# EAGLE design shield (EAGLE 6.3)
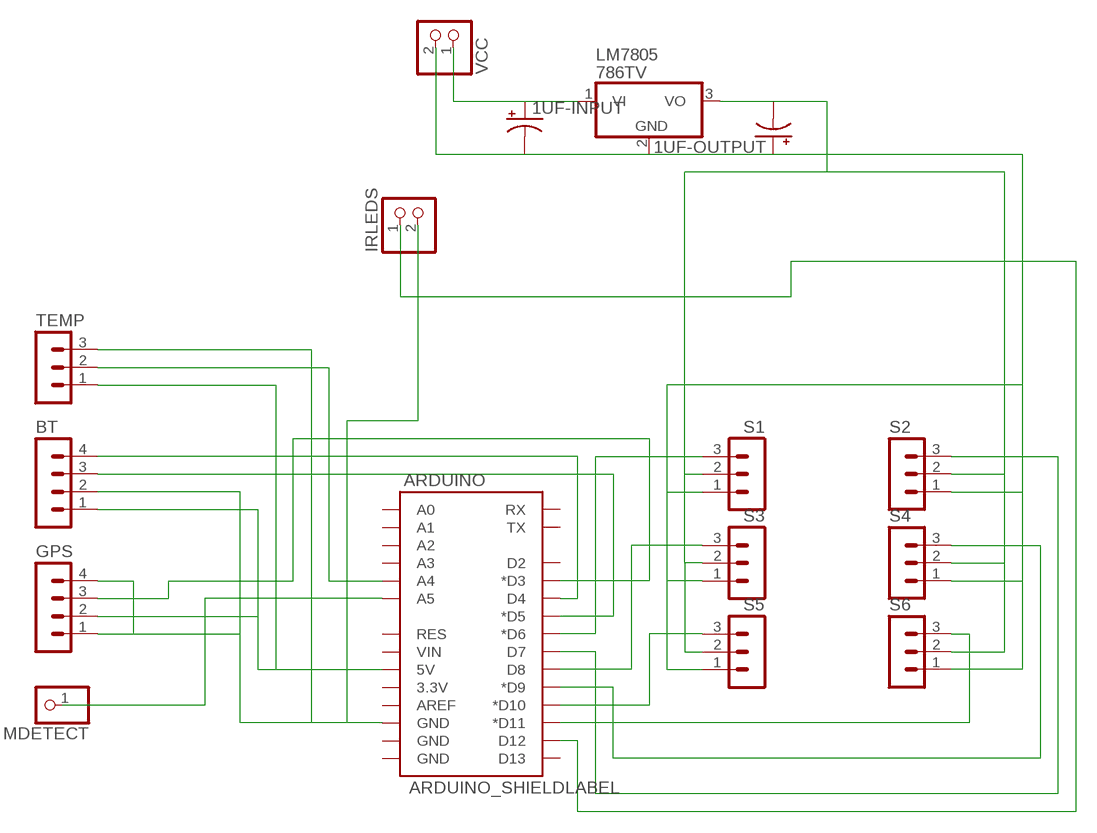
[diagram p0: schematic, sheet 1]

## Parts
1UF-INPUT  CAP_POLPTH4  [CPOL-RADIAL-1000UF-25V]
1UF-OUTPUT  CAP_POLPTH4  [CPOL-RADIAL-1000UF-25V]
ARDUINO  ARDUINO_SHIELDLABEL  [DUEMILANOVE_SHIELD]
BT  MA04-1  [MA04-1]
GPS  MA04-1  [MA04-1]
IRLEDS  PINHD-1X2  [1X02]
LM7805  786TV  [TO220V]
MDETECT  PINHD-1X1  [1X01]
S1  MA03-1  [MA03-1]
S2  MA03-1  [MA03-1]
S3  MA03-1  [MA03-1]
S4  MA03-1  [MA03-1]
S5  MA03-1  [MA03-1]
S6  MA03-1  [MA03-1]
TEMP  MA03-1  [MA03-1]
VCC  PINHD-1X2  [1X02]

## Nets
MDETECT: ARDUINO.A5 MDETECT.1
N$1: ARDUINO.D12 IRLEDS.1
N$3: ARDUINO.D6(*D6) S1.3
N$4: ARDUINO.D7 S2.3
N$5: ARDUINO.D8 S3.3
N$6: ARDUINO.D9(*D9) S4.3
N$7: ARDUINO.D10(*D10) S5.3
N$8: ARDUINO.D11(*D11) S6.3
N$9: ARDUINO.5V BT.1 GPS.2 TEMP.1
N$10: ARDUINO.GND@2(GND) BT.2 GPS.1 GPS.4 IRLEDS.2 TEMP.3
N$11: ARDUINO.D5(*D5) BT.3
N$12: ARDUINO.D4 BT.4
N$13: ARDUINO.D3(*D3) GPS.3
N$14: ARDUINO.A4 TEMP.2
N$15: 1UF-INPUT.1(+) LM7805.1(VI) VCC.1
N$16: 1UF-INPUT.2(-) 1UF-OUTPUT.1(+) LM7805.2(GND) S1.1 S2.1 S3.1 S4.1 S5.1 S6.1 VCC.2
N$17: 1UF-OUTPUT.2(-) LM7805.3(VO) S1.2 S2.2 S3.2 S4.2 S5.2 S6.2
Unconnected: ARDUINO.3.3V ARDUINO.A0 ARDUINO.A1 ARDUINO.A2 ARDUINO.A3 ARDUINO.AREF ARDUINO.D2 ARDUINO.D13 ARDUINO.GND@0(GND) ARDUINO.GND@1(GND) ARDUINO.RES ARDUINO.RX ARDUINO.TX ARDUINO.VIN

## Library data of the parts
1UF-INPUT 1UF-OUTPUT = SparkFun-Passives:CAP_POL: Capacitor Polarized These are standard SMD and PTH capacitors. Normally 10uF, 47uF, and 100uF in electrolytic and tantalum varieties. Always verify the external diameter of the through hole cap, it varies with capacity, voltage, and manufacturer. The EIA devices should be standard.
ARDUINO = SparkFun-Boards:ARDUINO_SHIELD: Arduino shield footprint
BT GPS = con-lstb:MA04-1: PIN HEADER; OC_FARNELL: unknown; OC_NEWARK: unknown
IRLEDS VCC = pinhead:PINHD-1X2: PIN HEADER
LM7805 = linear:78*: Positive VOLTAGE REGULATOR Source: http://cache.national.com/ds/LM/LM78L05.pdf http://www.fairchildsemi.com/ds/LM/LM7805.pdf
MDETECT = pinhead:PINHD-1X1: PIN HEADER
S1-S6 TEMP = con-lstb:MA03-1: PIN HEADER; OC_FARNELL: unknown; OC_NEWARK: unknown

## Board
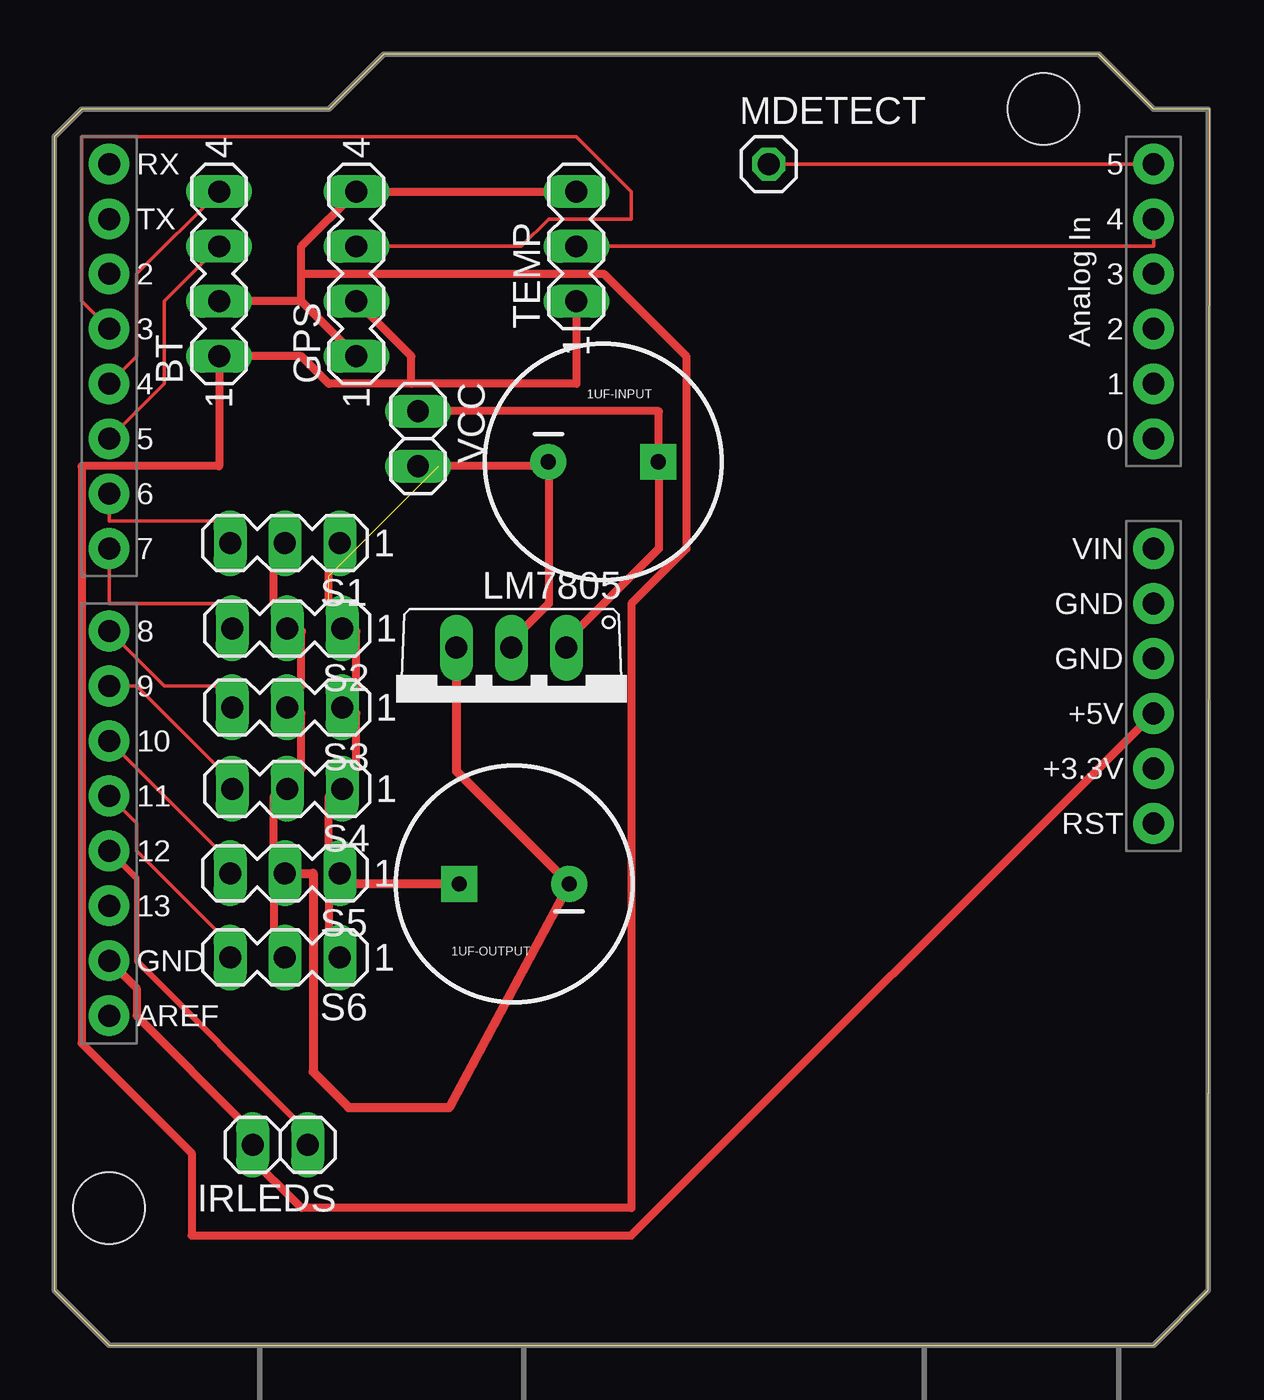
[diagram p1: board, top side]

Size 53.39 x 59.69 mm. Coordinates in mm from the lower left corner, seen from the top.
Outline: 2.54,0 50.8,0 53.34,2.54 53.39,57.14 50.81,57.14 48.26,59.69 15.24,59.69 12.7,57.15 1.27,57.15 0,55.87 0,2.54 2.54,0
Copper layers (1*16): Top 0.035mm / dielectric 1.5mm / Bottom 0.035mm
Design rules "Fusion_eagle_rule_v1.1": minimum track width 6mil, minimum drill 12mil, track to track 6mil, track to pad 6mil, pad to pad 6mil, via to via 6mil, smd to smd 0mil, copper to edge 10mil, drill to drill 10mil, minimum pad ring 10mil, minimum via ring 6mil, stop-mask expansion 2mil, vias tented up to drill 100mil, thermal gap 10mil

### Footprints (pad centres in the part's own frame; a part is rotated, then mirrored left to right if it is on the bottom)
CPOL-RADIAL-1000UF-25V = drill 0.7 pad 1.651 square: 1 2.54,0 | drill 0.7 pad 1.651: 2 -2.54,0
DUEMILANOVE_SHIELD = drill 1.016 pad 1.88: 3.3V 50.8,26.67; 5V 50.8,29.21; A0 50.8,41.91; A1 50.8,44.45; A2 50.8,46.99; A3 50.8,49.53; A4 50.8,52.07; A5 50.8,54.61; AREF 2.54,15.24; D2 2.54,49.53; D3 2.54,46.99; D4 2.54,44.45; D5 2.54,41.91; D6 2.54,39.37; D7 2.54,36.83; D8 2.54,33.02; D9 2.54,30.48; D10 2.54,27.94; D11 2.54,25.4; D12 2.54,22.86; D13 2.54,20.32; GND@0 50.8,31.75; GND@1 50.8,34.29; GND@2 2.54,17.78; RES 50.8,24.13; RX 2.54,54.61; TX 2.54,52.07; VIN 50.8,36.83 | hole 3.302: 45.72,57.15; 2.54,6.35
MA04-1 = drill 1.016 long: 1 -3.81,0; 2 -1.27,0; 3 1.27,0; 4 3.81,0
1X02 = drill 1.016 long: 1 -1.27,0; 2 1.27,0
TO220V = drill 1.016 long: 1 -2.54,-2.54; 2 0,-2.54; 3 2.54,-2.54
1X01 = drill 1.016 octagon: 1 0,0
MA03-1 = drill 1.016 long: 1 -2.54,0; 2 0,0; 3 2.54,0

### Placement (x,y rotation side)
1UF-INPUT  25.37,40.84 0 top
1UF-OUTPUT  21.26,21.34 180 top
ARDUINO  0,0 0 top
BT  7.62,49.53 90 top
GPS  13.97,49.53 90 top
IRLEDS  10.44,9.27 180 top
LM7805  21.13,29.72 180 top
MDETECT  33.02,54.61 0 top
S1  10.67,37.08 180 top
S2  10.77,33.15 180 top
S3  10.77,29.49 180 top
S4  10.77,25.73 180 top
S5  10.67,21.82 180 top
S6  10.67,17.93 180 top
TEMP  24.13,50.8 90 top
VCC  16.81,41.91 270 top

### Tracks (layer width: path | path; a pad name or v marks a point on that pad's centre or on a via)
MDETECT
  Top 0.152: ARDUINO.A5 MDETECT.1
N$1
  Top 0.254: ARDUINO.D12 3.81,21.59 3.81,17.78 11.43,10.16 IRLEDS.1
N$3
  Top 0.152: ARDUINO.D6 2.54,38.1 7.62,38.1 S1.3
N$4
  Top 0.152: ARDUINO.D7 2.54,34.29 7.62,34.29 S2.3
N$5
  Top 0.152: ARDUINO.D8 5.08,30.48 7.62,30.48 S3.3
N$6
  Top 0.152: ARDUINO.D9 3.81,30.48 7.62,26.67 S4.3
N$7
  Top 0.152: ARDUINO.D10 7.62,22.86 S5.3
N$8
  Top 0.152: ARDUINO.D11 3.81,24.13 3.81,22.86 7.62,19.05 S6.3
N$9
  Top 0.381: 16.51,44.45 24.13,44.45 TEMP.1 | 16.51,44.45 12.7,44.45 11.43,45.72 BT.1 7.62,40.64 1.27,40.64 1.27,13.97 6.35,8.89 6.35,5.08 26.67,5.08 ARDUINO.5V | GPS.2 16.51,45.72 16.51,44.45
N$10
  Top 0.381: ARDUINO.GND@2 3.81,16.51 3.81,15.24 8.89,10.16 IRLEDS.2 8.89,8.89 11.43,6.35 26.67,6.35 26.67,34.29 29.21,36.83 29.21,45.72 25.4,49.53 11.43,49.53 | 11.43,48.26 BT.2 | GPS.1 11.43,48.26 | 11.43,48.26 11.43,49.53 | 11.43,49.53 11.43,50.8 GPS.4 TEMP.3
N$11
  Top 0.152: BT.3 5.08,48.26 5.08,44.45 ARDUINO.D5
N$12
  Top 0.152: BT.4 3.81,49.53 3.81,45.72 ARDUINO.D4
N$13
  Top 0.152: GPS.3 21.59,50.8 22.86,52.07 26.67,52.07 26.67,53.34 24.13,55.88 1.27,55.88 1.27,48.26 ARDUINO.D3
N$14
  Top 0.152: TEMP.2 50.8,50.8 ARDUINO.A4
N$15
  Top 0.152: 27.94,40.64 1UF-INPUT.1
  Top 0.381: LM7805.1 24.13,33.02 27.94,36.83 27.94,40.64 27.94,43.18 VCC.1
N$16  (2 unrouted)
  Top 0.152: 22.86,40.64 1UF-INPUT.2 | 17.78,40.64 VCC.2
  Top 0.381: LM7805.2 21.59,33.02 22.86,34.29 22.86,40.64 VCC.2 | S6.1 12.7,19.05 12.7,21.59 S5.1 12.7,22.86 12.7,25.4 S4.1 13.97,26.67 13.97,29.21 S3.1 13.97,30.48 13.97,33.02 S2.1 12.7,34.29 12.7,36.83 S1.1
  Top 0.406: 1UF-OUTPUT.1 13.69,21.34 S5.1
N$17
  Top 0.152: 10.16,21.59 S5.2 | 11.43,33.02 S2.2 | 10.16,36.83 S1.2
  Top 0.381: 10.16,21.59 10.16,19.05 S6.2 | S5.2 10.16,22.86 10.16,25.4 S4.2 11.43,26.67 11.43,29.21 S3.2 11.43,30.48 11.43,33.02 | 10.16,36.83 10.16,34.29 S2.2
  Top 0.406: S5.2 11.96,21.82 11.96,12.65 13.61,11 18.24,11 18.29,11.05 1UF-OUTPUT.2 18.59,26.54 LM7805.3 | 11.43,33.02 10.69,33.02

### Text on the board
tOrigins: Multi-Purpose Rescue and investigation Robot | 2013 | SARAJEVO COLLEGE | MP RAIR | IHSAN ISIK / FEHIM TRNKA